# Altium schematic sheet tsPicoTop.SchDoc
size A; SheetNumber: 1; SheetTotal: 5
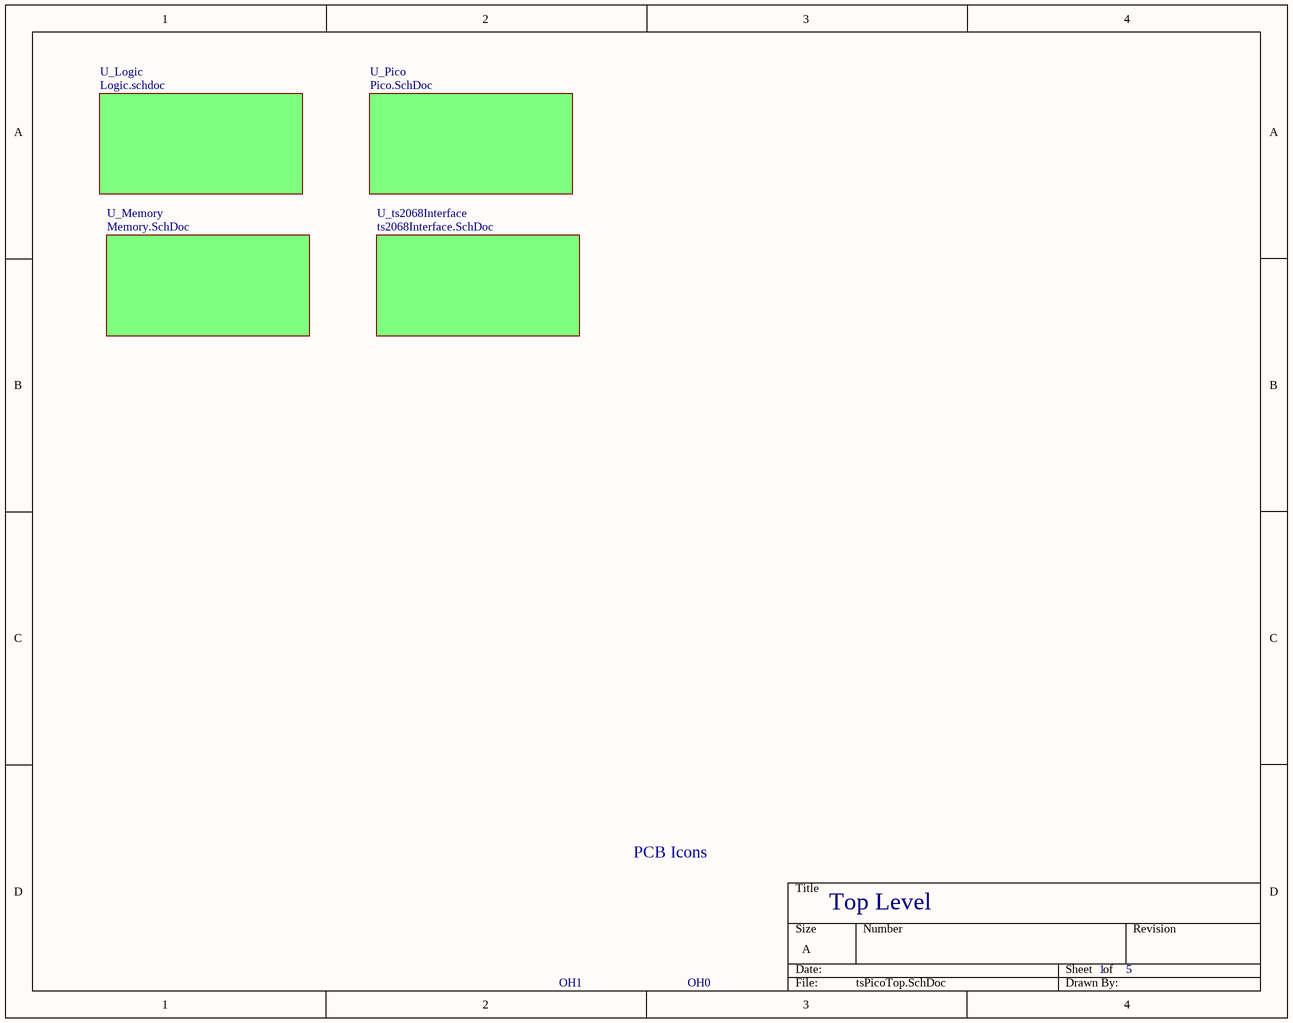
[diagram p0: tsPicoTop.SchDoc]

## Parts
OH0  OPENHW_PCB  [OpenHW]  (value not drawn)
OH1  OPENHW_SCH  (value not drawn)

## Sub-sheets
U_Logic = Logic.schdoc: no entries
U_Memory = Memory.SchDoc: no entries
U_Pico = Pico.SchDoc: no entries
U_ts2068Interface = ts2068Interface.SchDoc: no entries

## Notes on the sheet
- PCB Icons
- Top Level